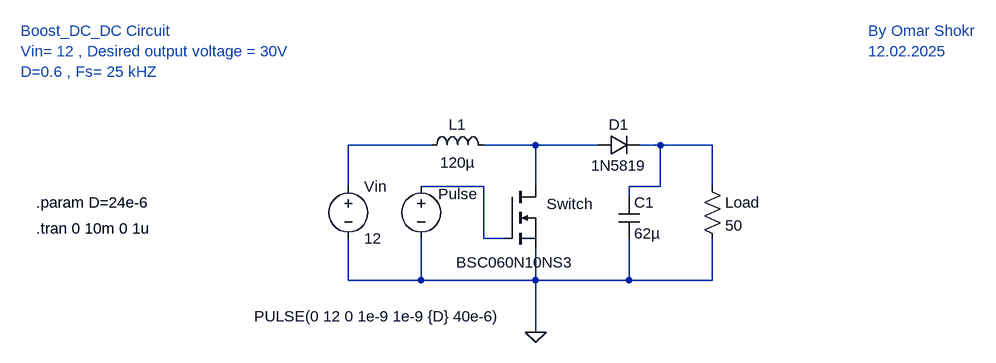
[diagram p0: schematic Boost_DC_DC_Omar (1).asc]
Boost_DC_DC_Omar (1).asc, the LTspice schematic file:
Version 4.1
SHEET 1 976 680
WIRE 128 80 0 80
WIRE 288 80 208 80
WIRE 384 80 288 80
WIRE 480 80 448 80
WIRE 560 80 480 80
WIRE 0 144 0 80
WIRE 208 144 112 144
WIRE 288 144 288 80
WIRE 480 144 480 80
WIRE 480 144 432 144
WIRE 560 144 560 80
WIRE 432 160 432 144
WIRE 208 224 208 144
WIRE 240 224 208 224
WIRE 0 288 0 224
WIRE 112 288 112 224
WIRE 112 288 0 288
WIRE 288 288 288 240
WIRE 288 288 112 288
WIRE 432 288 432 224
WIRE 432 288 288 288
WIRE 560 288 560 224
WIRE 560 288 432 288
WIRE 288 368 288 288
FLAG 288 368 0
SYMBOL voltage 0 128 R0
WINDOW 123 0 0 Left 0
WINDOW 39 0 0 Left 0
SYMATTR InstName Vin
SYMATTR Value 12
SYMBOL res 544 128 R0
SYMATTR InstName Load
SYMATTR Value 50
SYMBOL cap 416 160 R0
SYMATTR InstName C1
SYMATTR Value 62µ
SYMBOL ind 112 96 R270
WINDOW 0 32 56 VTop 2
WINDOW 3 5 56 VBottom 2
SYMATTR InstName L1
SYMATTR Value 120µ
SYMBOL nmos 240 144 R0
WINDOW 0 65 27 Left 2
WINDOW 3 -74 117 Left 2
SYMATTR InstName Switch
SYMATTR Value BSC060N10NS3
SYMBOL diode 384 96 R270
WINDOW 0 32 32 VTop 2
WINDOW 3 0 32 VBottom 2
SYMATTR InstName D1
SYMATTR Value 1N5819
SYMBOL voltage 112 128 R0
WINDOW 0 26 27 Left 2
WINDOW 3 -257 216 Left 2
WINDOW 123 0 0 Left 0
WINDOW 39 0 0 Left 0
SYMATTR InstName Pulse
SYMATTR Value PULSE(0 12 0 1e-9 1e-9 {D} 40e-6)
TEXT -480 208 Left 2 !.tran 0 10m 0 1u
TEXT -480 168 Left 2 !.param D=24e-6
TEXT -504 -96 Left 2 ;Boost_DC_DC Circuit \nVin= 12 , Desired output voltage = 30V\nD=0.6 , Fs= 25 kHZ
TEXT 800 -96 Left 2 ;By Omar Shokr\n12.02.2025

The netlist it stands for:
* Boost_DC_DC_Omar (1).asc
Vin N001 0 12
R§Load N003 0 50
C1 N003 0 62µ
L1 N001 N002 120µ
M§Switch N002 N004 0 0 BSC060N10NS3
D1 N002 N003 1N5819
V§Pulse N004 0 PULSE(0 12 0 1e-9 1e-9 {D} 40e-6)
.model D D
.lib standard.dio
.model NMOS NMOS
.model PMOS PMOS
.lib standard.mos
.tran 0 10m 0 1u
.param D=24e-6
* Boost_DC_DC Circuit
* Vin= 12 , Desired output voltage = 30V
* D=0.6 , Fs= 25 kHZ
* By Omar Shokr
* 12.02.2025
.backanno
.end